# Altium schematic sheet BUTTON_ENCODER.SchDoc
size A4; SheetNumber: 3; SheetTotal: 6
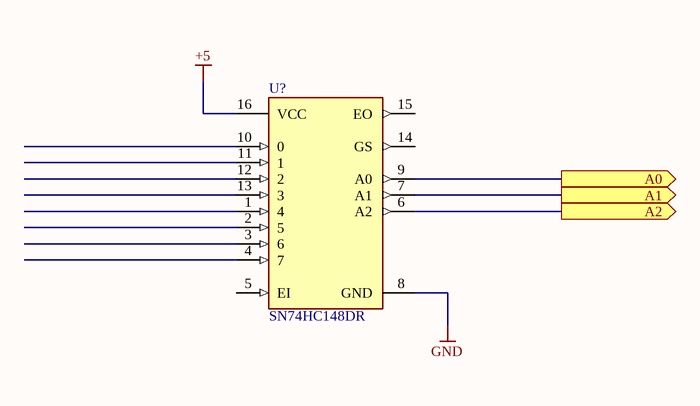
[diagram p0: BUTTON_ENCODER.SchDoc]

## Parts
U?  SN74HC148DR  [FP-D0016A-MFG]

## Ports
A0 (out), A1 (out), A2 (out)

## Nets
+5: U?.16(VCC)
GND: U?.8(GND)
A0: U?.9(A0) ; port A0
A1: U?.7(A1) ; port A1
A2: U?.6(A2) ; port A2

Not connected (* = marked no-connect by the designer): U? 1(4) 2(5) 3(6) 4(7) 5(EI) 10(0) 11(1) 12(2) 13(3) 14(GS) 15(EO)

## Library data of the parts
U? = CMP-1633-00066-3: IC PRIORITY ENCODER 8-3L 16-SOIC; Manufacturer: Texas Instruments; Logic Function Desc: Non-Inverting; Max Supply Voltage: 6V; Nominal Supply Current: 8uA; Number Of Inputs: 8; Standoff Height: 0.1mm; Number Of Circuits: 1; Propagation Delay: 21ns; Description: Priority Encoder 1 x 8:3 16-SOIC; Min Supply Voltage: 2V; Number Of Outputs: 3; Automotive: No; Digikey Description: IC PRIORITY ENCODER 8-3L 16-SOIC; ComponentLink2Description: Datasheet; Temperature: -40°C to +85°C; Octopart: https://octopart.com/sn74hc148dr-texas+instruments-3873395; RoHS: TRUE; Device Class L2: Logic ICs; Height: 1.75mm; Device Class L1: Integrated Circuits (ICs); Temperature Range High: +85°C; Mouser Description: Encoders, Decoders, Multiplexers & Demultiplexers 8-Line To 3-Line Priority Encoders; Package: D0016A; Ambient Temperature Range Low: -40°C; Device Class L3: unset; Manufacturer Part Number: SN74HC148DR; Ambient Temperature Range High: +85°C; Temperature Range Low: -40°C; Lead Free: Yes; ComponentLink2URL: http://www.ti.com/lit/ds/symlink/sn74hc148.pdf; Category: IC